# Altium schematic sheet power.SchDoc: RV-6 Power
size 381 x 241 mm; Author: George Hansel; DrawnBy: George Hansel; SheetNumber: 17; SheetTotal: 20; SPICEModelCacheQROLKWYH: <root> / <DocumentId>QROLKWYH</DocumentId> / <CacheFrame Number="0"> / <Model Name="spstrelay" Kind="CKT"> / <Text>*SPST Relay Subcircuit Parameters / *PULLIN     = Pull in voltage / *DROPOFF    = Drop off voltage / *CONTACT    = Contact resistance / *RESISTANCE = Coil resistance / *INDUCTANCE = Coil Inductance / * jjt 15/6/2002: changed DPST model to SPST. / * / *Generic DPST Relay / *Connections:     NO_A1 / *                 | NO_A2 / *                 | | T1 / *                 | | | T2 / *                 | | | | / *                 | | | | / *                 | | | | / *                 | | | | / .SUBCKT SPSTRELAY 1 2 4 5 / + PARAMS: PULLIN=4 DROPOFF=0.1 CONTACT=1m RESISTANCE=500 INDUCTANCE=10m / L1 4 6 {(INDUCTANCE/2)} / L2 5 7 {(INDUCTANCE/2)} / R1 6 7 {RESISTANCE} / * / BNO1 8 0 V={PULLIN}-abs(v(6,7)) / SW1 1 2 8 0 SWNO OFF / * / .MODEL SWNO SW(VT={(PULLIN*0.98)} RON={CONTACT} ) / .ENDS SPSTRELAY</Text> / </Model> / <Model Name="10tq035" Kind="MDL"> / <Text>*10TQ035 MCE 3/26/98 / *Ref: IR Power Semiconductors Product Digest '94 / *MCE 35V 10A 3us pkg:TO-220 3,1 / .MODEL 10TQ035 D (IS=14.2N RS=4.2M N=1.7 BV=35 IBV=15M / + CJO=412P VJ=0.75 M=0.333 TT=4.32U EG=.69 XTI=2)</Text> / </Model> / <Model Name="dpstrelay" Kind="CKT"> / <Text>*DPST Relay Subcircuit Parameters / *PULLIN     = Pull in voltage / *DROPOFF    = Drop off voltage / *CONTACT    = Contact resistance / *RESISTANCE = Coil resistance / *INDUCTANCE = Coil Inductance / * jjt 15/6/2002: changed DPDT model to DPST. / * / *Generic DPST Relay / *Connections:     NO_A1 / *                 | NO_A2 / *                 | | NO_B1 / *                 | | | NO_B2 / *                 | | | |  T1 / *                 | | | |  | T2 / *                 | | | |  | | / *                 | | | |  | | / *                 | | | |  | | / *                 | | | |  | | / .SUBCKT DPSTRELAY 1 2 3 10 4 5 / + PARAMS: PULLIN=4 DROPOFF=0.1 CONTACT=1m RESISTANCE=500 INDUCTANCE=10m / L1 4 6 {(INDUCTANCE/2)} / L2 5 7 {(INDUCTANCE/2)} / R1 6 7 {RESISTANCE} / * / BNO1 8 0 V={PULLIN}-abs(v(6,7)) / SW1 1 2 8 0 SWNO OFF / * / BNO2 9 0 V={PULLIN}-abs(v(6,7)) / SW2 3 10 9 0 SWNO OFF / * / .MODEL SWNO SW(VT={(PULLIN*0.98)} RON={CONTACT} ) / .ENDS DPSTRELAY</Text> / </Model> / </CacheFrame> / </root>
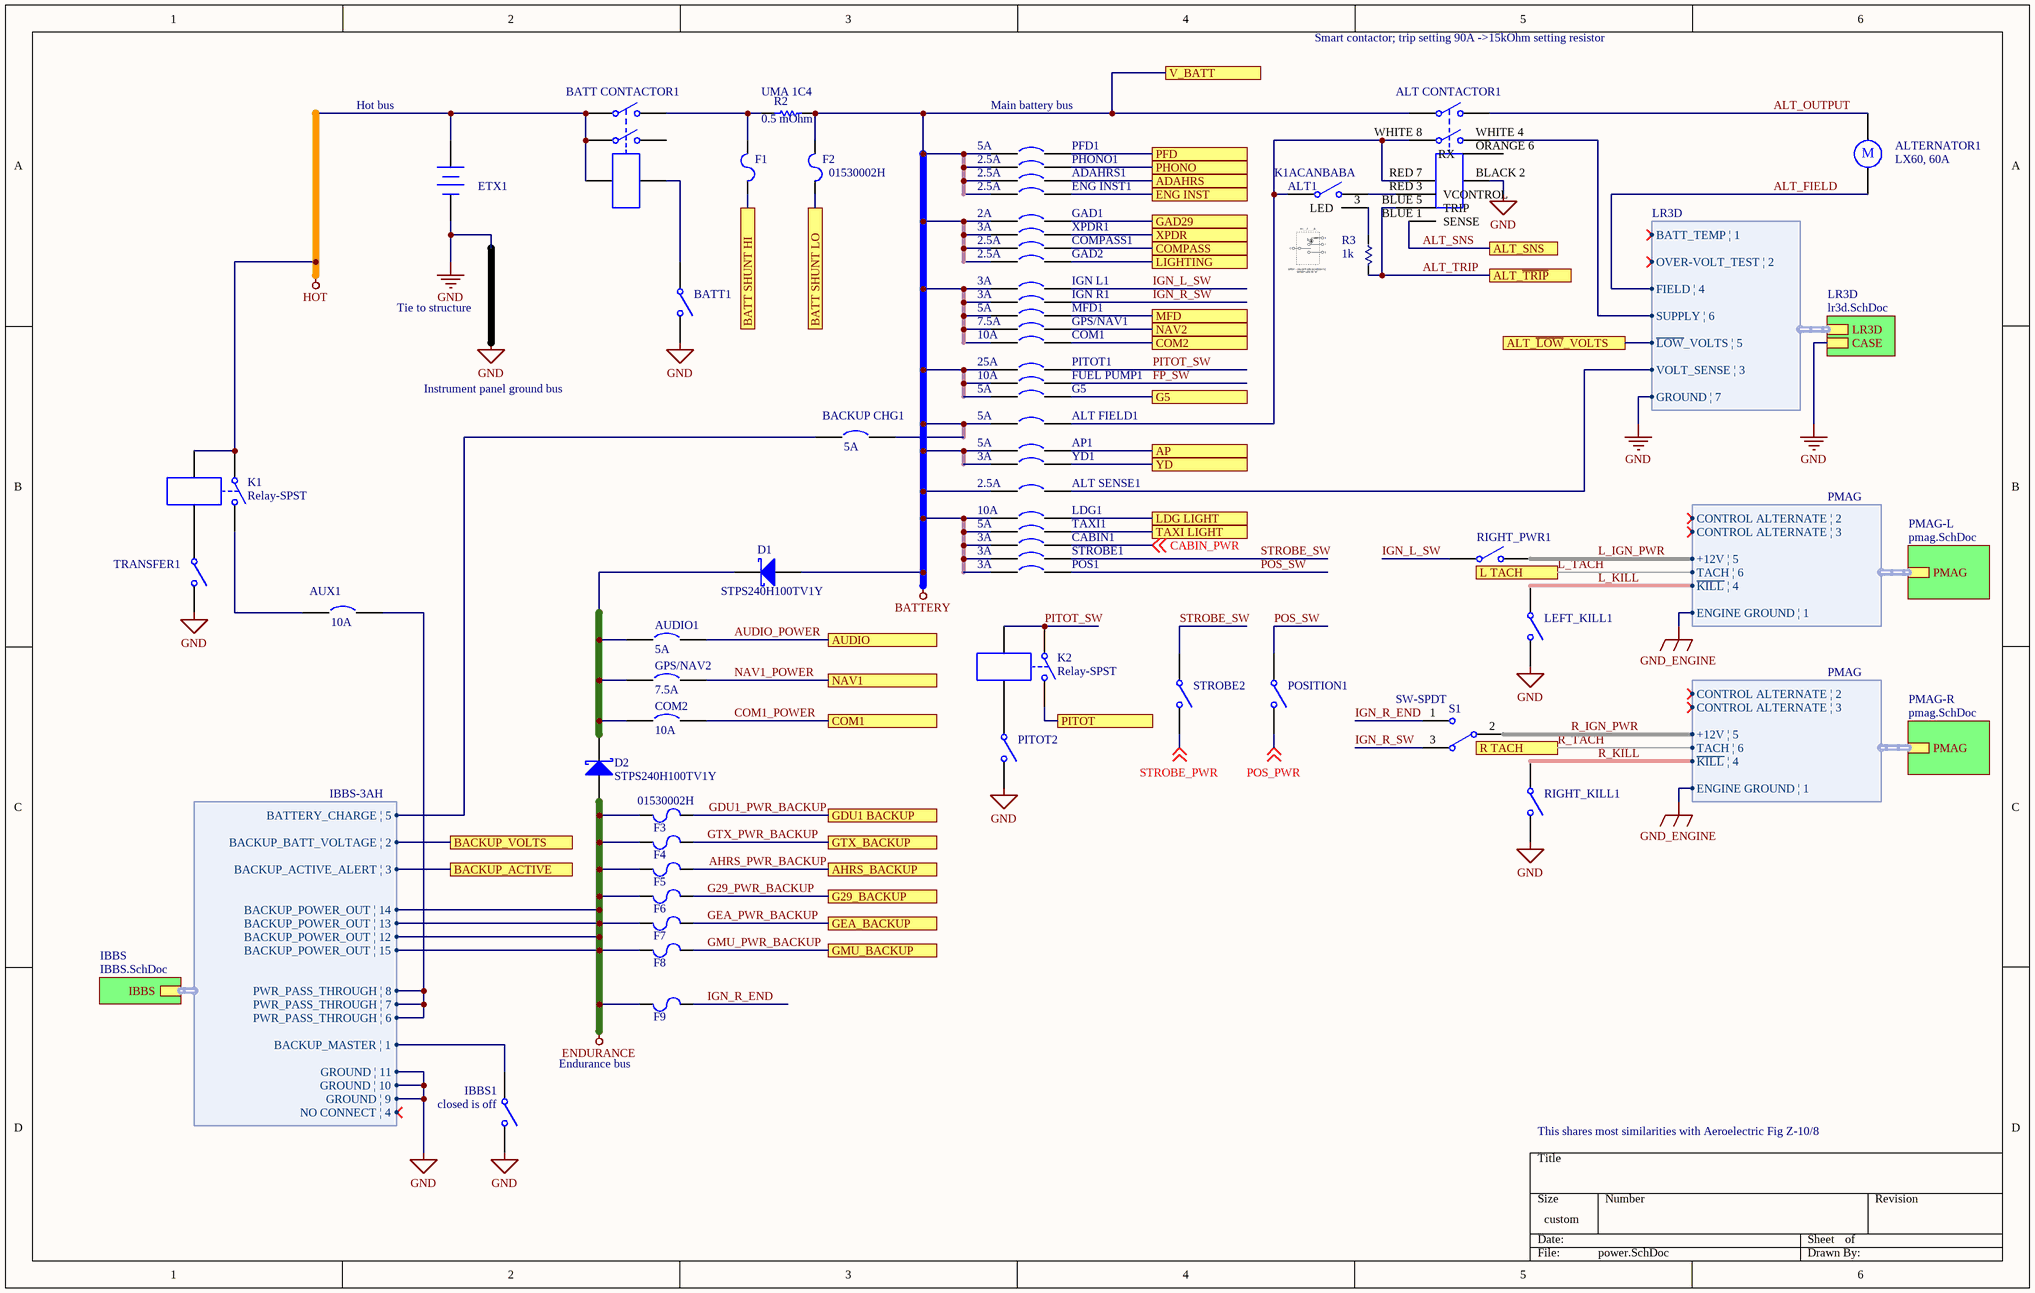
[diagram p0: power.SchDoc]

## Parts
ADAHRS1  2.5A  [SPST-2]
ALT1  SW-SPST  [SPST-2]  (value not drawn)
ALT_CONTACTOR1  Smart contactor; trip setting 90A ->15kOhm setting resistor  [MODULE6]
ALT_FIELD1  5A  [SPST-2]
ALT_SENSE1  2.5A  [SPST-2]
ALTERNATOR1  LX60, 60A  [RB5-10.5]
AP1  5A  [SPST-2]
AUDIO1  5A  [SPST-2]
AUX1  10A  [SPST-2]
BACKUP_CHG1  5A  [SPST-2]
BATT1  SW-SPST  [SPST-2]  (value not drawn)
BATT_CONTACTOR1  Relay-DPST  [MODULE6]  (value not drawn)
CABIN1  3A  [SPST-2]
COM1  10A  [SPST-2]
COM2  10A  [SPST-2]
COMPASS1  2.5A  [SPST-2]
D1  STPS240H100TV1Y  [TO-220AC]
D2  STPS240H100TV1Y  [TO-220AC]
ENG_INST1  2.5A  [SPST-2]
ETX1  Battery  [BAT-2]  (value not drawn)
F1  Fuse  (value not drawn)
F2  01530002H
F3  01530002H
F4  Fuse  (value not drawn)
F5  Fuse  (value not drawn)
F6  Fuse  (value not drawn)
F7  Fuse  (value not drawn)
F8  Fuse  (value not drawn)
F9  Fuse  (value not drawn)
FUEL_PUMP1  10A  [SPST-2]
G5  5A  [SPST-2]
GAD1  2A  [SPST-2]
GAD2  2.5A  [SPST-2]
GPS/NAV1  7.5A  [SPST-2]
GPS/NAV2  7.5A  [SPST-2]
IBBS1  SW-SPST  [SPST-2]  (value not drawn)
IGN_L1  3A  [SPST-2]
IGN_R1  3A  [SPST-2]
K1  Relay-SPST  [MODULE4]
K2  Relay-SPST  [MODULE4]
LDG1  10A  [SPST-2]
LEFT_KILL1  SW-SPST  [SPST-2]  (value not drawn)
MFD1  5A  [SPST-2]
PFD1  5A  [SPST-2]
PHONO1  2.5A  [SPST-2]
PITOT1  25A  [SPST-2]
PITOT2  SW-SPST  [SPST-2]  (value not drawn)
POS1  3A  [SPST-2]
POSITION1  SW-SPST  [SPST-2]  (value not drawn)
R2  UMA 1C4  value 0.5 mOhm  [AXIAL-0.3]
R3  Resistance (Ohms): 1k  [RESC1608L]  (hidden comment: RN60D1001FRE6)
RIGHT_KILL1  SW-SPST  [SPST-2]  (value not drawn)
RIGHT_PWR1  SW-SPST  [SPST-2]  (value not drawn)
S1  SW-SPDT  [TL36WW15050]
STROBE1  3A  [SPST-2]
STROBE2  SW-SPST  [SPST-2]  (value not drawn)
TAXI1  5A  [SPST-2]
TRANSFER1  SW-SPST  [SPST-2]  (value not drawn)
XPDR1  3A  [SPST-2]
YD1  3A  [SPST-2]

## Sub-sheets
IBBS = IBBS.SchDoc: IBBS (harness IBBS-3AH)
LR3D = lr3d.SchDoc: CASE, LR3D (harness LR3D)
PMAG-L = pmag.SchDoc: PMAG (harness PMAG)
PMAG-R = pmag.SchDoc: PMAG (harness PMAG)

## Ports
ADAHRS, AHRS_BACKUP, ALT_SNS, ALT_~{LOW}_VOLTS, ALT_~{TRIP}, AP, AUDIO, BACKUP_ACTIVE, BACKUP_VOLTS, BATT SHUNT HI, BATT SHUNT LO, COM1, COM2, COMPASS, ENG INST, G5, G29_BACKUP, GAD29, GDU1 BACKUP, GEA_BACKUP, GMU_BACKUP, GTX_BACKUP, L TACH, LDG LIGHT, LIGHTING, MFD, NAV1, NAV2, PFD, PHONO, PITOT, R TACH, TAXI LIGHT, V_BATT, XPDR, YD

## Harnesses
IBBS-3AH: BACKUP_MASTER | 1, BACKUP_BATT_VOLTAGE | 2, BACKUP_ACTIVE_ALERT | 3, NO CONNECT | 4, BATTERY_CHARGE | 5, PWR_PASS_THROUGH | 6, PWR_PASS_THROUGH | 7, PWR_PASS_THROUGH | 8, GROUND | 9, GROUND | 10, GROUND | 11, BACKUP_POWER_OUT | 12, BACKUP_POWER_OUT | 13, BACKUP_POWER_OUT | 14, BACKUP_POWER_OUT | 15
LR3D: BATT_TEMP | 1, OVER-VOLT_TEST | 2, VOLT_SENSE | 3, FIELD | 4, ~{LOW}_VOLTS | 5, SUPPLY | 6, GROUND | 7
PMAG: ENGINE GROUND | 1, CONTROL ALTERNATE | 2, CONTROL ALTERNATE | 3, ~{KILL} | 4, +12V | 5, TACH | 6

## Nets
BATTERY: ADAHRS1.1 ALT_CONTACTOR1.1 ALT_FIELD1.1 ALT_SENSE1.1 AP1.1 BACKUP_CHG1.2 CABIN1.1 COM1.1 COMPASS1.1 D1.3(A) ENG_INST1.1 F2.13 FUEL_PUMP1.1 G5.1 GAD1.1 GAD2.1 GPS/NAV1.1 IGN_L1.1 IGN_R1.1 LDG1.1 MFD1.1 PFD1.1 PHONO1.1 PITOT1.1 POS1.1 R2.2 STROBE1.1 TAXI1.1 XPDR1.1 YD1.1 ; port V_BATT
ENDURANCE: D2.3(A) F3.13 F4.13 F5.13 F6.13 F7.13 F8.13 F9.13 ; sheet IBBS/IBBS.BACKUP_POWER_OUT | 12, sheet IBBS/IBBS.BACKUP_POWER_OUT | 13, sheet IBBS/IBBS.BACKUP_POWER_OUT | 14, sheet IBBS/IBBS.BACKUP_POWER_OUT | 15
GND: ALT_CONTACTOR1.BLACK_2 BATT1.2(NO) ETX1.2(-) IBBS1.2(NO) LEFT_KILL1.2(NO) PITOT2.2(NO) RIGHT_KILL1.2(NO) TRANSFER1.2(NO) ; sheet LR3D/CASE, sheet IBBS/IBBS.GROUND | 9, sheet IBBS/IBBS.GROUND | 10, sheet IBBS/IBBS.GROUND | 11, sheet LR3D/LR3D.GROUND | 7
GND_ENGINE: sheet PMAG-L/PMAG.ENGINE GROUND | 1, sheet PMAG-R/PMAG.ENGINE GROUND | 1
HOT: BATT_CONTACTOR1.1 BATT_CONTACTOR1.3 BATT_CONTACTOR1.5 ETX1.1(+) K1.1 K1.3
ADAHRS: ADAHRS1.2 ; port ADAHRS
AHRS_PWR_BACKUP: F5.14 ; port AHRS_BACKUP
ALT_FIELD: ALTERNATOR1.2 ; sheet LR3D/LR3D.FIELD | 4
ALT_~{LOW}_VOLTS: port ALT_~{LOW}_VOLTS, sheet LR3D/LR3D.~{LOW}_VOLTS | 5
ALT_OUTPUT: ALT_CONTACTOR1.2 ALTERNATOR1.1
ALT_SNS: ALT_CONTACTOR1.BLUE_1(SENSE) ; port ALT_SNS
ALT_TRIP: ALT_CONTACTOR1.BLUE_5(TRIP) R3.2 ; port ALT_~{TRIP}
AP: AP1.2 ; port AP
AUDIO_POWER: AUDIO1.2 ; port AUDIO
BACKUP_ACTIVE: port BACKUP_ACTIVE, sheet IBBS/IBBS.BACKUP_ACTIVE_ALERT | 3
BACKUP_VOLTS: port BACKUP_VOLTS, sheet IBBS/IBBS.BACKUP_BATT_VOLTAGE | 2
BATT SHUNT HI: F1.14 ; port BATT SHUNT HI
BATT SHUNT LO: F2.14 ; port BATT SHUNT LO
CABIN_PWR: CABIN1.2 ; off-sheet CABIN_PWR
COM1_POWER: COM2.2 ; port COM1
COM2: COM1.2 ; port COM2
COMPASS: COMPASS1.2 ; port COMPASS
ENG INST: ENG_INST1.2 ; port ENG INST
FP_SW: FUEL_PUMP1.2
G5: G5.2 ; port G5
G29_PWR_BACKUP: F6.14 ; port G29_BACKUP
GAD29: GAD1.2 ; port GAD29
GDU1_PWR_BACKUP: F3.14 ; port GDU1 BACKUP
GEA_PWR_BACKUP: F7.14 ; port GEA_BACKUP
GMU_PWR_BACKUP: F8.14 ; port GMU_BACKUP
GTX_PWR_BACKUP: F4.14 ; port GTX_BACKUP
IGN_L_SW: IGN_L1.2 RIGHT_PWR1.1(COMMON)
IGN_R_END: F9.14 S1.1
IGN_R_SW: IGN_R1.2 S1.3
L_IGN_PWR: RIGHT_PWR1.2(NO) ; sheet PMAG-L/PMAG.+12V | 5
L_~{KILL}: LEFT_KILL1.1(COMMON) ; sheet PMAG-L/PMAG.~{KILL} | 4
L_TACH: port L TACH, sheet PMAG-L/PMAG.TACH | 6
LDG LIGHT: LDG1.2 ; port LDG LIGHT
LIGHTING: GAD2.2 ; port LIGHTING
MFD: MFD1.2 ; port MFD
NAV1_POWER: GPS/NAV2.2 ; port NAV1
NAV2: GPS/NAV1.2 ; port NAV2
PFD: PFD1.2 ; port PFD
PHONO: PHONO1.2 ; port PHONO
PITOT: K2.2 ; port PITOT
PITOT_SW: K2.1 K2.3 PITOT1.2
POS_PWR: POSITION1.2(NO) ; off-sheet POS_PWR
POS_SW: POS1.2 POSITION1.1(COMMON)
R_IGN_PWR: S1.2 ; sheet PMAG-R/PMAG.+12V | 5
R_~{KILL}: RIGHT_KILL1.1(COMMON) ; sheet PMAG-R/PMAG.~{KILL} | 4
R_TACH: port R TACH, sheet PMAG-R/PMAG.TACH | 6
STROBE_PWR: STROBE2.2(NO) ; off-sheet STROBE_PWR
STROBE_SW: STROBE1.2 STROBE2.1(COMMON)
TAXI LIGHT: TAXI1.2 ; port TAXI LIGHT
XPDR: XPDR1.2 ; port XPDR
YD: YD1.2 ; port YD
NetALT1_1: ALT1.1(NO) ALT_CONTACTOR1.RED_3(VCONTROL)
NetALT1_3: ALT1.3(LED) R3.1
NetALT1_C: ALT1.C ALT_CONTACTOR1.RED_7 ALT_CONTACTOR1.WHITE_8 ALT_FIELD1.2
NetALT_CONTACTOR1_WHITE 4: ALT_CONTACTOR1.WHITE_4 ; sheet LR3D/LR3D.SUPPLY | 6
NetALT_SENSE1_2: ALT_SENSE1.2 ; sheet LR3D/LR3D.VOLT_SENSE | 3
NetAUDIO1_1: AUDIO1.1 COM2.1 D1.1(K) D2.1(K) GPS/NAV2.1
NetAUX1_1: AUX1.1 K1.2
NetAUX1_2: AUX1.2 ; sheet IBBS/IBBS.PWR_PASS_THROUGH | 6, sheet IBBS/IBBS.PWR_PASS_THROUGH | 7, sheet IBBS/IBBS.PWR_PASS_THROUGH | 8
NetBACKUP_CHG1_1: BACKUP_CHG1.1 ; sheet IBBS/IBBS.BATTERY_CHARGE | 5
NetBATT1_1: BATT1.1(COMMON) BATT_CONTACTOR1.6
NetBATT_CONTACTOR1_2: BATT_CONTACTOR1.2 F1.13 R2.1
NetIBBS1_1: IBBS1.1(COMMON) ; sheet IBBS/IBBS.BACKUP_MASTER | 1
NetK1_4: K1.4 TRANSFER1.1(COMMON)
NetK2_4: K2.4 PITOT2.1(COMMON)

Not connected (* = marked no-connect by the designer): ALT_CONTACTOR1 ORANGE 6(RX); BATT_CONTACTOR1 4

## Notes on the sheet
- Hot bus
- Main battery bus
- (near ALT1) K1ACANBABA
- Tie to structure
- Instrument panel ground bus
- (near IBBS1) closed is off
- Endurance bus
- This shares most similarities with Aeroelectric Fig Z-10/8
- (in symbol Motor) M

## Library data of the parts
ADAHRS1 ALT_FIELD1 ALT_SENSE1 AP1 AUDIO1 AUX1 BACKUP_CHG1 CABIN1 COM1 COM2 COMPASS1 ENG_INST1 FUEL_PUMP1 G5 GAD1 GAD2 GPS/NAV1 GPS/NAV2 IGN_L1 IGN_R1 LDG1 MFD1 PFD1 PHONO1 PITOT1 POS1 STROBE1 TAXI1 XPDR1 YD1 = Circuit Breaker: Published: 24-Mar-1999; LatestRevisionDate: 17-Jul-2002; LatestRevisionNote: Re-released for DXP Platform.; PackageReference: SPST-2; Publisher: Altium Limited; PackageDescription: Switch; 2 Leads
ALT1 BATT1 IBBS1 LEFT_KILL1 PITOT2 POSITION1 RIGHT_KILL1 RIGHT_PWR1 STROBE2 TRANSFER1 = SW-SPST: Single-Pole, Single-Throw Switch; Published: 24-Mar-1999; LatestRevisionDate: 17-Jul-2002; LatestRevisionNote: Re-released for DXP Platform.; PackageReference: SPST-2; Publisher: Altium Limited; PackageDescription: Switch; 2 Leads
ALT_CONTACTOR1 BATT_CONTACTOR1 = Relay-DPST: Dual-Pole Single-Throw Relay; Published: 24-Mar-1999; LatestRevisionDate: 17-Jul-2002; LatestRevisionNote: Re-released for DXP Platform.; PackageReference: MODULE6; Publisher: Altium Limited
ALTERNATOR1 = Motor: Motor, General Kind; Published: 24-Mar-1999; LatestRevisionDate: 17-Jul-2002; LatestRevisionNote: Re-released for DXP Platform.; PackageReference: RB5-10.5; Publisher: Altium Limited; PackageDescription: Capacitor (Radial); 2 Leads
D1 D2 = Diode 10TQ035: Schottky Rectifier; Note: Terminal 2 is the TAB and is electrically connected to the cathode; Published: 8-Jun-2000; LatestRevisionDate: 17-Jul-2002; LatestRevisionNote: Re-released for DXP Platform.; DatasheetVersion: PD-2.057B; PackageVersion: Feb-1998; PackageReference: TO-220AC; Publisher: Altium Limited; PackageDescription: TO, Thru-Hole, Vertical, Heatsink Mounted; 3 In-Line Leads (1 Absent); Pitch 2.54 mm; ComponentLink1Description: Manufacturer Link; ComponentLink1URL: http://www.irf.com/; ComponentLink2Description: Datasheet; ComponentLink2URL: http://www.irf.com/product-info/datasheets/data/10tq.pdf
ETX1 = Battery: Multicell Battery; Published: 24-Mar-1999; LatestRevisionDate: 17-Jul-2002; LatestRevisionNote: Re-released for DXP Platform.; PackageReference: BAT-2; Publisher: Altium Limited; PackageDescription: Battery; 2 Leads
F2 F3 = Fuse
K1 K2 = Relay-SPST: Single-Pole Single-Throw Relay; Published: 24-Mar-1999; LatestRevisionDate: 17-Jul-2002; LatestRevisionNote: Re-released for DXP Platform.; PackageReference: MODULE4; Publisher: Altium Limited
R2 = Res1: Resistor; Published: 8-Jun-2000; LatestRevisionDate: 17-Jul-2002; LatestRevisionNote: Re-released for DXP Platform.; PackageReference: AXIAL-0.3; Publisher: Altium Limited; PackageDescription: Axial Device, Thru-Hole; 2 Leads; 0.3 in Pin Spacing
R3 = RES_470-0603: Manufacturer 1: Panasonic Electronic Components; Manufacturer Part Number 1: ERJ-3GEYJ471V; Description 1: RES 470 OHM 1/10W 5% 0603 SMD; Category 1: Resistors; Tolerance: ±5%; Power (Watts): 0.1W, 1/10W; Temperature Coefficient: ±200ppm/°C; Supplier 1: Digi-Key; Supplier Part Number 1: P470GCT-ND; RoHS 1: RoHS Compliant; Stock 1: 4254662; Pricing 1: 1=0.1, 50=0.0126, 100=0.0096, 250=0.00716, 500=0.00528, 1000=0.00352, 2500=0.00297 (USD); Packaging: Cut Tape (CT); Composition: Thick Film; Features: Automotive AEC-Q200 Qualified; Package / Case: 0603 (1608 Metric); Supplier Device Package: 0603; Size / Dimension: 0.063" L x 0.031" W (1.60mm x 0.80mm); Height: 0.022" (0.55mm); Number of Terminations: 2; ComponentLink1URL: http://industrial.panasonic.com/www-cgi/jvcr13pz.cgi?E+PZ+3+AOA0001+ERJ3GEYJ471V+7+WW; ComponentLink1Description: http://industrial.panasonic.com/www-cgi/jvcr13pz.cgi?E+PZ+3+AOA0001+ERJ3GEYJ471V+7+WW
S1 = SW-SPDT: SPDT Subminiature Toggle Switch, Right Angle Mounting, Vertical Actuation; Published: 24-Mar-1999; LatestRevisionDate: 17-Dec-2003; LatestRevisionNote: Schematic revised, PCB Footprint replaced.; DatasheetVersion: 05-Dec-2000; PackageReference: TL36WW15050; Publisher: Altium Limited; PackageDescription: Switch; 4 Leads; ComponentLink1Description: Manufacturer Link; ComponentLink1URL: http://www.apem.com